# Altium schematic sheet Printer-Pi-Pro_Schematic.schdoc
size 307 x 218 mm; Symbol: Drawing-Symbol_A4; Device: Drawing-Symbol_A4; @Project Name: Printer Pi Pro; @Page Count: 1; @Update Date: 2025-06-26; @Create Date: 2025-06-26; @Schematic Name: Schematic1; @Page No: 1; @Page Name: P1; Company: EasyEDA.com; Version: V1.0; Page Size: A4; @Create Time: 12:09:01; @Update Time: 18:44:01; Width: 1170; Height: 825; Region Start: 1; X Region Count: 6; Y Region Count: 4; Blade Width: 10; Title Block Position: 3; @Board Name: Board1
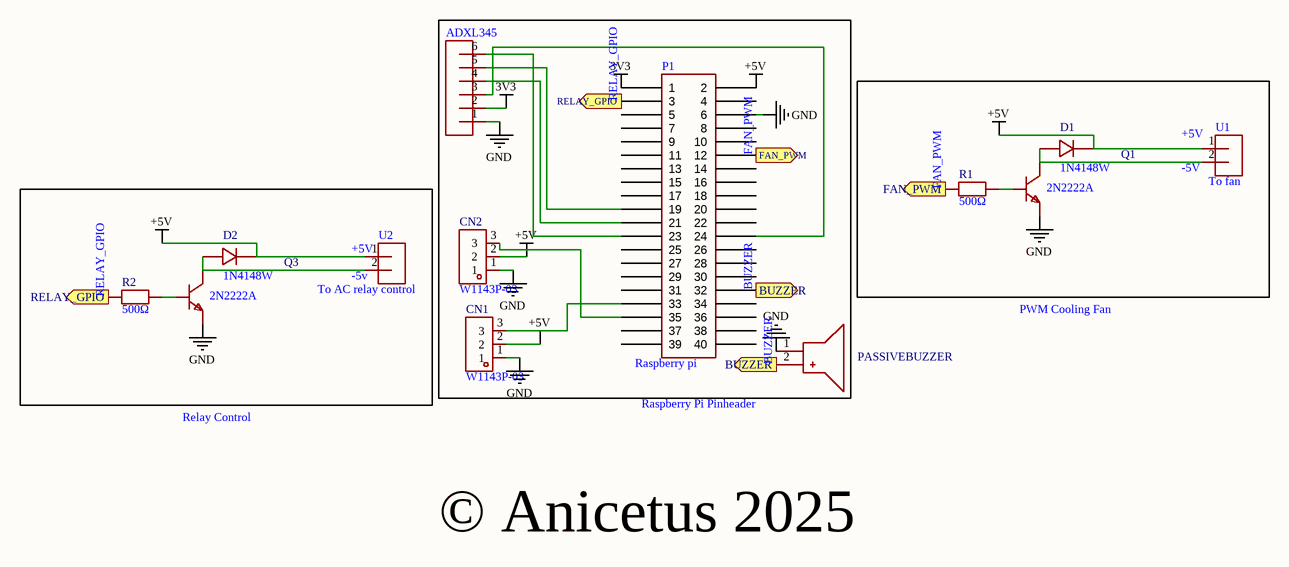
[diagram p0: Printer-Pi-Pro_Schematic.schdoc]

## Parts
ADXL345  (no value)  [CONN-TH_6P-P2.50_C9900020524]
CN1  W1143P-03  [HDR-TH_203S-Y-1X03PG]
CN2  W1143P-03  [HDR-TH_203S-Y-1X03PG]
D1  1N4148W  [SOD-123F_L2.7-W1.6-LS3.8-RD]
D2  1N4148W  [SOD-123F_L2.7-W1.6-LS3.8-RD]
P1  Raspberry pi  [HDR-20X2/2.54]
PASSIVEBUZZER  buzzer  [BUZ-TH_BD12.0-P6.00-D0.9-RD]  (value not drawn)
Q1  2N2222A  [2N2222A]
Q3  2N2222A  [2N2222A]
R1  500Ω  [R0805]
R2  500Ω  [R0805]
U1  (no value)  [JST-XH 2p]
U2  (no value)  [JST-XH 2p]

## Ports
BUZZER (out), FAN_PWM (out), RELAY_GPIO (out)

## Nets
3V3: ADXL345.2 P1.1
+5V: CN1.2 CN2.2 D1.1(K) D2.1(K) P1.2 U1.1 U2.1
GND: ADXL345.1 CN1.1 CN2.1 P1.6 PASSIVEBUZZER.1(-) Q1.1(E) Q3.1(E)
BUZZER: P1.32 PASSIVEBUZZER.2(+) ; port BUZZER
FAN_PWM: P1.12 R1.2 ; port FAN_PWM
RELAY_GPIO: P1.3 R2.2 ; port RELAY_GPIO
NetADXL345_3: ADXL345.3 P1.24
NetADXL345_4: ADXL345.4 P1.21
NetADXL345_5: ADXL345.5 P1.19
NetADXL345_6: ADXL345.6 P1.23
NetCN1_3: CN1.3 P1.33
NetCN2_3: CN2.3 P1.35
NetD1_2: D1.2(A) Q1.3(C) U1.2
NetD2_2: D2.2(A) Q3.3(C) U2.2
NetQ1_2: Q1.2(B) R1.1
NetQ3_2: Q3.2(B) R2.1

Not connected (* = marked no-connect by the designer): P1 4 5 7 8 9 10 11 13 14 15 16 17 18 20 22 25 26 27 28 29 30 31 34 36 37 38 39 40

## Notes on the sheet
- (near U1) +5V
- (near U1) -5V
- (near U1) To fan
- (near U2) To AC relay control
- (near U2) +5V
- (near U2) -5v
- PWM Cooling Fan
- Relay Control
- Raspberry Pi Pinheader
- © Anicetus 2025
- 1
- 2
- 3
- 4
- 5
- 6
- A
- B
- C
- Schematic
- Schematic1
- Create at
- Update at
- 2025-06-26
- Board
- Drawn
- Board1
- Page
- P1
- D
- Reviewed
- Version
- Size
- Printer Pi Pro
- Page  1  Total  1
- V1.0
- A4
- EasyEDA.com

## Library data of the parts
ADXL345 = JST-XH 6p: Add into BOM: yes; Symbol: JST-XH 6p; Device: JST-XH 6p; Convert to PCB: yes
CN1 CN2 = W1143P-03: Add into BOM: yes; Symbol: W1143P-03; Device: W1143P-03; LCSC Part Name: W1143P-03; Supplier Part: C9900002555; Manufacturer Part: W1143P-03; Supplier Footprint: 3PIN-2.54mm母头DIP; JLCPCB Part Class: Extended Part; Supplier: LCSC; Convert to PCB: yes
D1 D2 = 1N4148W_C81598: Manufacturer: ST(先科); Add into BOM: yes; Diode Configuration: Independent Type; Forward Voltage (Vf@If): 1V@50mA; Reverse Leakage Current (Ir): 1uA@75V; Symbol: 1N4148W_C81598; Device: 1N4148W_C81598; LCSC Part Name: 1N4148W; Supplier Part: C81598; Manufacturer Part: 1N4148W; Supplier Footprint: SOD-123; JLCPCB Part Class: Basic Part; Datasheet: https://atta.szlcsc.com/upload/public/pdf/source/20161024/1477288446905.pdf; Supplier: LCSC; Convert to PCB: yes; Operating Temperature: -
P1 = Raspberry pi: Manufacturer: EasyEDA; Manufacturer Part: Header-Female-2.54_2x20; EasyEDA: E50982; Convert to PCB: yes; Symbol: Raspberry pi; Device: Raspberry pi; Supplier Part: E50982; Supplier: EasyEDA; Add into BOM: yes
PASSIVEBUZZER = buzzer: Add into BOM: yes; Symbol: BUZZER; Device: buzzer; LCSC Part Name: buzzer; Supplier Part: C9900014030; Manufacturer Part: buzzer; Supplier Footprint: buzzer; JLCPCB Part Class: Extended Part; Supplier: LCSC; Convert to PCB: yes
Q1 Q3 = 2N2222A_C20616319: Manufacturer: HXY MOSFET(华轩阳电子); Add into BOM: yes; type: NPN; Current - Collector(Ic): 600mA; Transition frequency(fT): 300MHz; Symbol: 2N2222A_C20616319; Device: 2N2222A_C20616319; LCSC Part Name: 2N2222A; Supplier Part: C20616319; Manufacturer Part: 2N2222A; Supplier Footprint: TO-92; JLCPCB Part Class: Extended Part; Datasheet: https://atta.szlcsc.com/upload/public/pdf/source/20240126/569F653216AA5CF06DD2FDB4A0F71366.pdf; Supplier: LCSC; Convert to PCB: yes
R1 R2 = ARG05FTC5000: Manufacturer: Viking(光颉); Add into BOM: yes; Tolerance: ±1%; Temperature Coefficient: ±25ppm/℃; Symbol: ARG05FTC5000; Device: ARG05FTC5000; LCSC Part Name: 薄膜电阻 500Ω ±1% 125mW; Supplier Part: C2828857; Manufacturer Part: ARG05FTC5000; Supplier Footprint: 0805; JLCPCB Part Class: Extended Part; Datasheet: https://atta.szlcsc.com/upload/public/pdf/source/20210426/C2828737_35D2DDB0BDDA00747C2712435E28BBD4.pdf; Supplier: LCSC; Convert to PCB: yes; Type: Thin Film Resistor; Value: 500Ω; Operating Temperature Range: -55℃~+155℃
U1 U2 = JST-XH 2p: Add into BOM: yes; Symbol: JST-XH 2p; Device: JST-XH 2p; Convert to PCB: yes